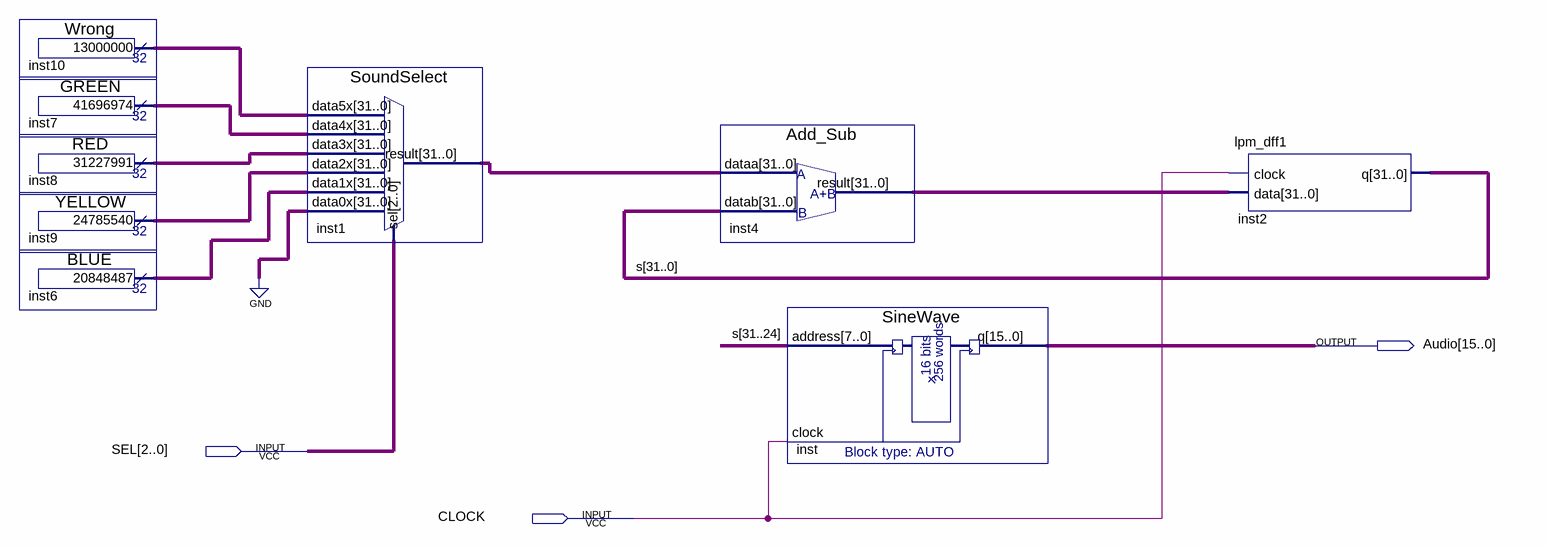
[diagram p0: schematic sheet]
// Quartus schematic Audio2.bdf as structural Verilog: 9 symbols, 3 pins
module Audio2 (
  input  [2:0] SEL,
  input  CLOCK,
  output [15:0] Audio
);

  wire [31:0] inst1_result, inst4_result, inst6_result, inst7_result, inst8_result, inst9_result,
       inst10_result, s;

  Wrong inst10 (.result(inst10_result));
  GREEN inst7 (.result(inst7_result));
  RED inst8 (.result(inst8_result));
  YELLOW inst9 (.result(inst9_result));
  BLUE inst6 (.result(inst6_result));
  SoundSelect inst1 (
    .data5x(inst10_result), .data4x(inst7_result), .data3x(inst8_result), .data2x(inst9_result),
    .data1x(inst6_result), .data0x({32{1'b0}}), .sel(SEL), .result(inst1_result));
  Add_Sub inst4 (.dataa(inst1_result), .datab(s), .result(inst4_result));
  SineWave inst (.address(s[31:24]), .clock(CLOCK), .q(Audio));
  lpm_dff1 inst2 (.clock(CLOCK), .data(inst4_result), .q(s));
endmodule
